# Altium schematic sheet STM32.SchDoc
size A; SheetNumber: 2; SheetTotal: 18
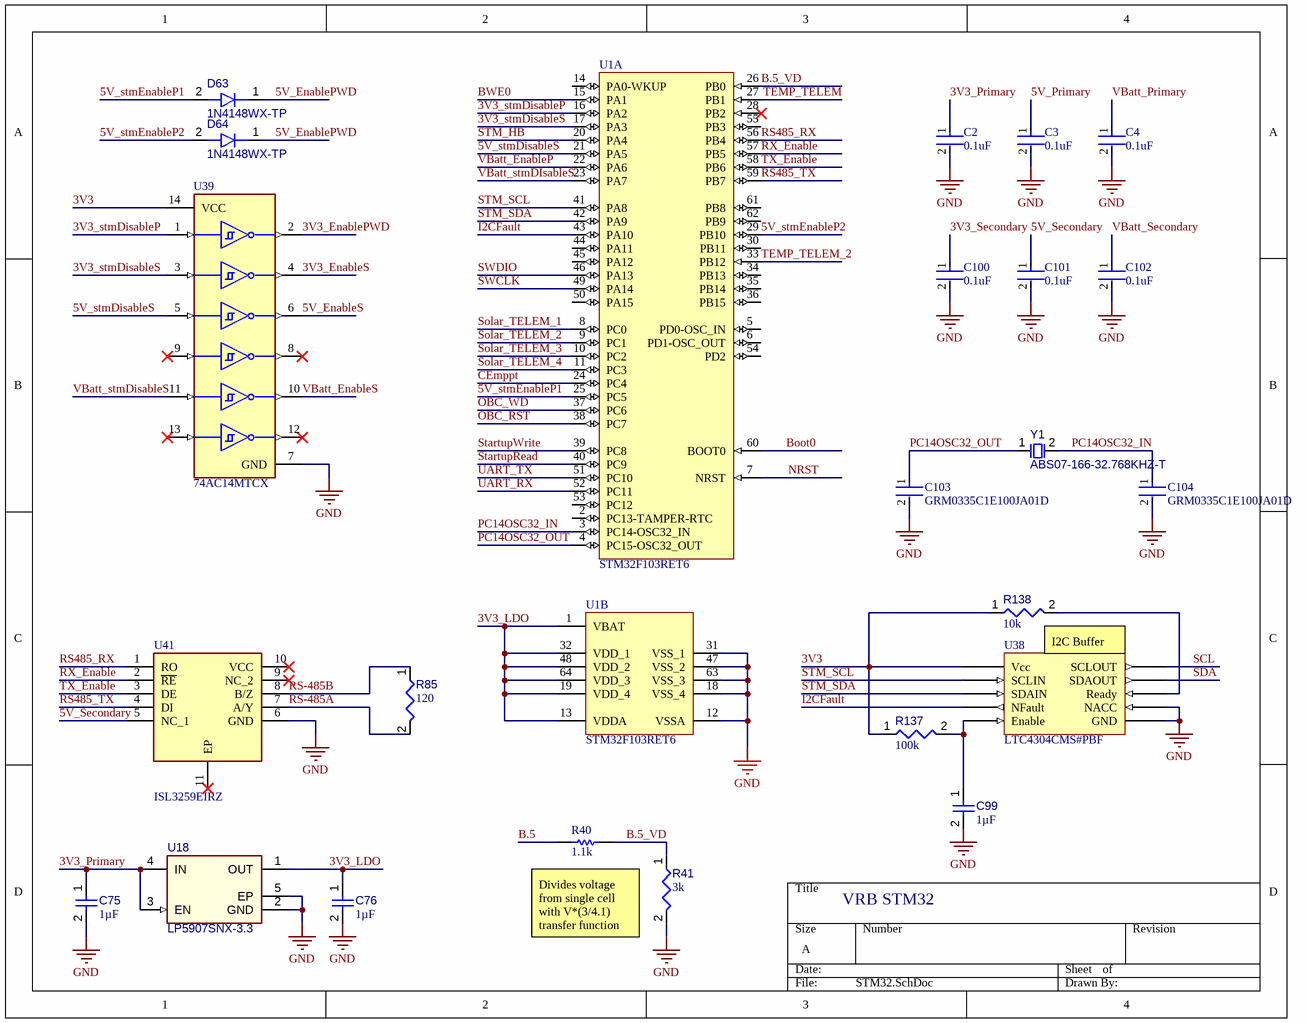
[diagram p0: STM32.SchDoc]

## Parts
C2  0.1uF  [FP-C0603-CJ-MFG]
C3  0.1uF  [FP-C0603-CJ-MFG]
C4  0.1uF  [FP-C0603-CJ-MFG]
C75  value 1µF  [FP-CC0201-BA-IPC_A]  (hidden comment: CC0201KRX5R5BB105)
C76  value 1µF  [FP-CC0201-BA-IPC_A]  (hidden comment: CC0201KRX5R5BB105)
C99  value 1µF  [CAPC1608X94X35NL15T15]  (hidden comment: Capacitor 1 uF +/- 10% 16 V 0603)
C100  0.1uF  [FP-C0603-CJ-MFG]
C101  0.1uF  [FP-C0603-CJ-MFG]
C102  0.1uF  [FP-C0603-CJ-MFG]
C103  GRM0335C1E100JA01D  [FP-GRM033-0_03-IPC_A]
C104  GRM0335C1E100JA01D  [FP-GRM033-0_03-IPC_A]
D63  1N4148WX-TP  [1N4148WX-TP-Footprint-1]
D64  1N4148WX-TP  [1N4148WX-TP-Footprint-1]
R40  1.1k  [RESC1005X40X25NL05T10]
R41  value 3k  [RESC0402(1005)_L]  (hidden comment: 3KR2F)
R85  value 120  [RESC0603(1608)_L]  (hidden comment: 120R3J)
R137  value 100k  [RESC3216X60X45ML15T20]  (hidden comment: Resistor 100k +/-1% 1206 250 mW)
R138  value 10k  [RESC1608X55X25ML10T15]  (hidden comment: Resistor 10k +/-1% 0603 100 mW)
U1  STM32F103RET6  [STM-LQFP64_N]  (parts A,B of 2)
U18  LP5907SNX-3.3  [TI-DQN4-480X480TP_V]
U38  LTC4304CMS#PBF  [LTC4304CMS#PBF-Footprint-1]
U39  74AC14MTCX  [FP-948G-MFG]
U41  ISL3259EIRZ  [ISL3259EIRZ-Footprint-1]
Y1  ABS07-166-32.768KHZ-T  [EPSON-FC-135_V]

## Nets
GND: C2.2 C3.2 C4.2 C75.2 C76.2 C99.2 C100.2 C101.2 C102.2 C103.2 C104.2 R41.2 U1.12(VSSA) U1.18(VSS_4) U1.31(VSS_1) U1.47(VSS_2) U1.63(VSS_3) U18.2(GND) U18.5(EP) U38.4(NACC) U38.5(GND) U39.7(GND) U41.6(GND)
3V3: R137.1 R138.1 U38.10(Vcc) U39.14(VCC)
3V3_EnablePWD: U39.2(~{O}0)
3V3_EnableS: U39.4(~{O}1)
3V3_LDO: C76.1 U1.1(VBAT) U1.13(VDDA) U1.19(VDD_4) U1.32(VDD_1) U1.48(VDD_2) U1.64(VDD_3) U18.1(OUT)
3V3_Primary: C2.1 C75.1 U18.3(EN) U18.4(IN)
3V3_Secondary: C100.1
3V3_stmDisableP: U1.16(PA2) U39.1(I0)
3V3_stmDisableS: U1.17(PA3) U39.3(I1)
5V_EnablePWD: D63.1(K) D64.1(K)
5V_EnableS: U39.6(~{O}2)
5V_Primary: C3.1
5V_Secondary: C101.1 U41.5(NC_1)
5V_stmDisableS: U1.21(PA5) U39.5(I2)
5V_stmEnableP1: D63.2(A) U1.25(PC5)
5V_stmEnableP2: D64.2(A) U1.29(PB10)
B.5: R40.1
B.5_VD: R40.2 R41.1 U1.26(PB0)
Boot0: U1.60(BOOT0)
BWE0: U1.15(PA1)
~{CEmppt}: U1.24(PC4)
I2CFault: U1.43(PA10) U38.7(NFault)
NRST: U1.7(NRST)
OBC_RST: U1.38(PC7)
OBC_WD: U1.37(PC6)
PC14OSC32_IN: C104.1 U1.3(PC14-OSC32_IN) Y1.2
PC14OSC32_OUT: C103.1 U1.4(PC15-OSC32_OUT) Y1.1
~{RX_Enable}: U1.57(PB5) U41.2(~{RE})
RS485_RX: U1.56(PB4) U41.1(RO)
RS485_TX: U1.59(PB7) U41.4(DI)
RS-485A: R85.2 U41.7(A/Y)
RS-485B: R85.1 U41.8(B/Z)
SCL: U38.2(SCLOUT)
SDA: U38.9(SDAOUT)
Solar_TELEM_1: U1.8(PC0)
Solar_TELEM_2: U1.9(PC1)
Solar_TELEM_3: U1.10(PC2)
Solar_TELEM_4: U1.11(PC3)
StartupRead: U1.40(PC9)
StartupWrite: U1.39(PC8)
STM_HB: U1.20(PA4)
STM_SCL: U1.41(PA8) U38.3(SCLIN)
STM_SDA: U1.42(PA9) U38.8(SDAIN)
SWCLK: U1.49(PA14)
SWDIO: U1.46(PA13)
TEMP_TELEM: U1.27(PB1)
TEMP_TELEM_2: U1.33(PB12)
TX_Enable: U1.58(PB6) U41.3(DE)
UART_RX: U1.52(PC11)
UART_TX: U1.51(PC10)
VBatt_EnableP: U1.22(PA6)
VBatt_EnableS: U39.10(~{O}4)
VBatt_Primary: C4.1
VBatt_Secondary: C102.1
VBatt_stmDIsableS: U1.23(PA7) U39.11(I4)
NetC99_1: C99.1 R137.2 U38.1(Enable)
NetR138_2: R138.2 U38.6(Ready)

Not connected (* = marked no-connect by the designer): U1 2(PC13-TAMPER-RTC) 5(PD0-OSC_IN) 6(PD1-OSC_OUT) 14(PA0-WKUP) 28(PB2)* 30(PB11) 34(PB13) 35(PB14) 36(PB15) 44(PA11) 45(PA12) 50(PA15) 53(PC12) 54(PD2) 55(PB3) 61(PB8) 62(PB9); U39 8(~{O}3)* 9(I3)* 12(~{O}5)* 13(I5)*; U41 9(NC_2)* 10(VCC)* 11(EP)*

## Notes on the sheet
- I2C Buffer
- VRB STM32
- Divides voltage from single cell with V*(3/4.1) transfer function

## Library data of the parts
C2-C4 C100-C102 = CMP-2006-03300-2: CAP CER 0.1UF 50V X7R 0603 / C0603X104K5RACTU; Manufacturer: Kemet; Capacitance: 100nF; Material: Ceramic; Tolerance: 10%; Value: 100nF; Temperature Coefficient: 15%; Temperature Range High: +125°C; Temperature Range Low: -55°C; Manufacturer Part Number: C0603X104K5RACTU; Voltage: 50V; ComponentLink2Description: Datasheet; RoHS: TRUE; ComponentLink2URL: https://content.kemet.com/datasheets/KEM_C1013_X7R_FT-CAP_SMD.pdf; Device Class L3: Ceramic Capacitors; Device Class L2: Capacitors; Package: C0603-CJ; Height: 0.95mm; Device Class L1: Passive Components; Temperature Characteristic: X7R; Lead Free: Yes; Digikey Description: CAP CER 0.1UF 50V X7R 0603; Automotive: No; Mouser Description: Capacitor; Ceramic; Cap 0.1uF; Tol+10%; SMT; Flexible Termination; Vol-Rtg 50V; TR; Temperature: -55°C to +125°C; Octopart: https://octopart.com/c0603x104k5ractu-kemet-9145062; Category: Cap; Voltage Rating: 50V; Ipc Land Pattern Name: CAPC16080X80
C75 C76 = CMP-001-00088-1: Ceramic Capacitor, Multilayer, Ceramic, 6.3V, 10% +Tol, 10% -Tol, X5R, 15% TC, 1uF, Surface Mount, 0201; Capacitor Type: Ceramic; Max Operating Temperature: 85°C; RoHS Compliant: Yes; Mounting Technology: Surface Mount; Min Operating Temperature: -55°C; Case/Package: 0201; Pins: 2
C99 = CMP-001-00003-6: Chip Capacitor, 1 uF, +/- 10%, 16 V, 0603 (1608 Metric); Voltage Rating: 16V; Capacitor Type: Ceramic; Max Operating Temperature: 125°C; Pins: 2; Tolerance: 10%; Min Operating Temperature: -55°C; RoHS Compliant: True; Mounting Technology: SM; Case/Package: 0603
C103 C104 = CMP-2010-01302-2: Chip Multilayer Ceramic Capacitors for General Purpose, 0201, 10pF, C0G, 30ppm/°C, 5%, 25V; Length: 0.024inch; Voltage Rating: 25V; Packaging: Tape and Reel; Max Operating Temperature: 125°C; Mount: Surface Mount; Capacitance: 10pF; Tolerance: 5%; Series: GRM; Case Code (Metric): 0603; Package Quantity: 1; Voltage Rating (DC): 25V; Depth: 0.3mm; Min Operating Temperature: -55°C; Width: 0.012inch; Thickness: 0.013inch; Termination: SMD/SMT; Lead Free: Lead Free; Case/Package: 0201; Case Code (Imperial): 0201; Dielectric: C0G; REACH SVHC: No SVHC
D63 = CMP-004-00035-2: Rectifier Diode, 1 Phase, 1 Element, 0.15A, 100V V(RRM), Silicon
D64 = CMP-004-00035-3: Rectifier Diode, 1 Phase, 1 Element, 0.15A, 100V V(RRM), Silicon
R40 = CMP-2002-07452-1: Part Number: RC0402FR-071K1L; Manufacturer: Yageo / Phycomp
R41 = CMP-009-00099-2: 3K 0.063W 1% 0402 (1005 Metric)  SMD; Power: 63mW; Case/Package: 0402; Tolerance: 1%; Mounting Technology: SMT; Pins: 2
R85 = CMP-009-00069-2: 120R 0.1W 5% 0603 (1608 Metric)  SMD; Power: 100mW; Mounting Technology: SMT; Tolerance: 5%; Case/Package: 0603; Pins: 2
R137 = CMP-009-00025-5: Chip Resistor, 100 KOhm, +/- 1%, 0.25 W, -55 to 155 degC, 1206 (3216 Metric); Voltage Rating: 200V; Power: 250mW; RoHS Compliant: True; Max Operating Temperature: 155°C; Pins: 2; Tolerance: 1%; Mounting Technology: SM; Case/Package: 1206; Min Operating Temperature: -55°C
R138 = CMP-009-00017-5: Chip Resistor, 10 KOhm, +/- 1%, 01 W, -55 to 155 degC, 0603 (1608 Metric); Voltage Rating: 50V; Power: 100mW; RoHS Compliant: True; Min Operating Temperature: -55°C; Pins: 2; Case/Package: 0603; Mounting Technology: SM; Max Operating Temperature: 155°C; Tolerance: 1%
U1 = CMP-0237-00201-3: ARM Cortex-M3 32-bit MCU, 512 KB Flash, 64 KB Internal RAM, 51 I/Os, 64-pin LQFP, -40 to 85 degC, Tray; FLASH Size (Prog) (kB): 512; Internal RAM Size (kB): 64; A/D Converter: 3x12-bit (16 Channel); I/Os (High Current): 51; Supply Voltage(Vcc) min (V): 2; D/A Converter: 2x12-bit (2 Channel); Operating Frequency(F) (Processor speed) (MHz): 72; PackageDescription: 64-Pin Low Profile Quad Flat Package, 10 x 10 mm Body, 0.5 mm Pitch; ComponentLink3URL: http://www.st.com/st-web-ui/static/active/en/resource/technical/document/datasheet/DM00037051.pdf; DatasheetVersion: Rev. 8; Packing: Tray; PackageReference: LQFP64; ComponentLink3Description: Package Specification; Core: ARM Cortex-M3; Mounting Technology: Surface Mount; PartNumber: STM32F103RET6; PackageVersion: Rev. 4, 06/2013; ComponentLink1URL: http://www.st.com/web/en/home.html; ComponentLink1Description: Manufacturer URL; ComponentLink2Description: Datasheet; ComponentLink2URL: http://www.st.com/st-web-ui/static/active/en/resource/technical/document/datasheet/CD00191185.pdf
U18 = CMP-019-00040-3: Ultra-Low-Noise, Low-IQ LDO, 3.3 V, 0.25 A, -40 to 125 degC, 4-Pin X2SON, RoHS, Tape and Reel; Output Voltage: 3.3V; Pins: 5; Max Operating Temperature: 125°C; Min Operating Temperature: -40°C
U38 = CMP-015-00009-7: Interface Circuit, PDSO10; Max Supply Voltage: 5.5V; Min Supply Voltage: 2.7V; Nominal Supply Voltage: 3.3V; RoHS Compliant: Yes; Max Operating Temperature: 70°C; Min Operating Temperature: 0°C; Pins: 10; Case/Package: TSSOP
U39 = CMP-016-00013-1: Inverter, AC Series, 6-Func, 1-Input, CMOS, PDSO14; Min Supply Voltage: 2V; Nominal Supply Voltage: 3.3V; Max Supply Voltage: 6V; RoHS Compliant: Yes; Case/Package: TSSOP; Min Operating Temperature: -40°C; Max Operating Temperature: 85°C; Pins: 14; Logic Type: INVERTER
U41 = CMP-015-00010-2: Line Transceiver, 1 Func, 1 Driver, 1 Rcvr, BICMOS, PDSO10; Min Supply Voltage: 4.75V; Nominal Supply Voltage: 5V; Max Supply Voltage: 5.25V; Case/Package: HVSON; RoHS Compliant: Yes; Pins: 10; Max Operating Temperature: 85°C; Min Operating Temperature: -40°C
Y1 = CMP-003-00029-1: Crystal 32.768kHz 10ppm 7pF -40C +85C; Pins: 2; Frequency: 32.768kHz